# EAGLE design miniTelemetry (EAGLE 5.11)
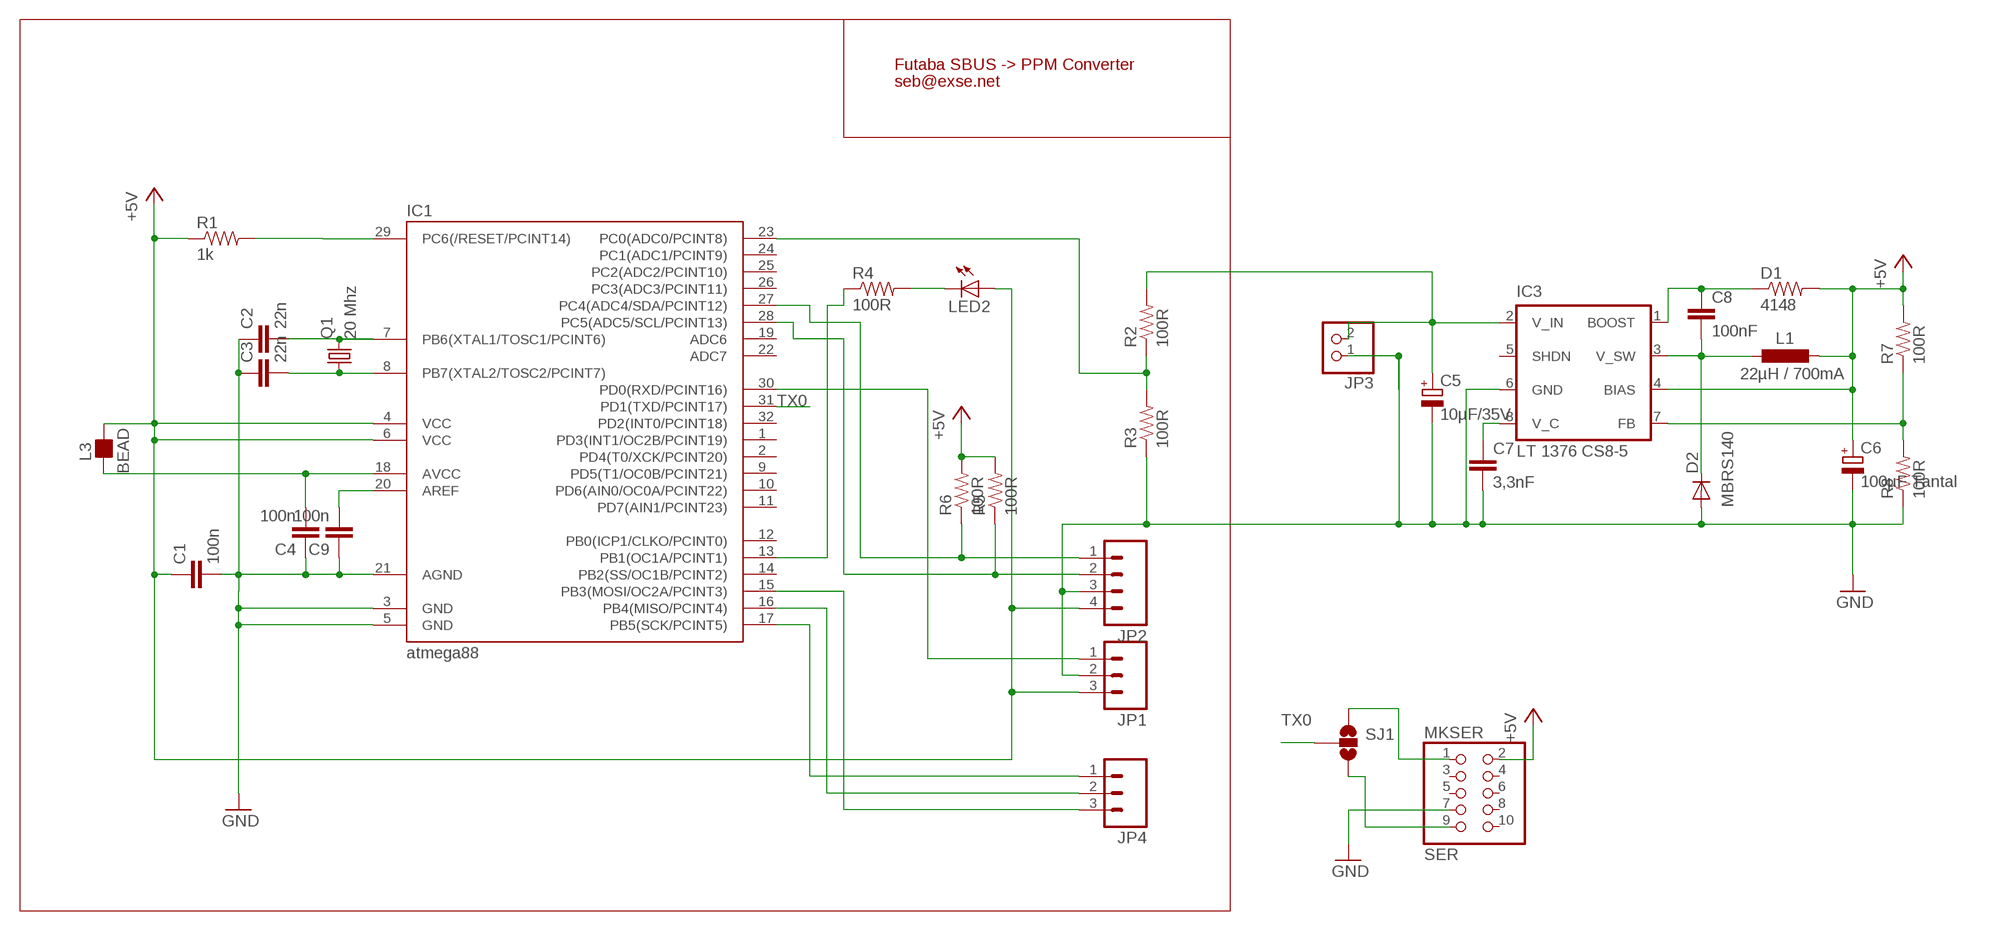
[diagram p0: schematic, sheet 1]

## Parts
C1  100n  CAP0805  [0805]
C2  22n  CAP0805  [0805]
C3  22n  CAP0805  [0805]
C4  100n  CAP0805  [0805]
C5  10µF/35V  CPOL-EUSMCD  [SMC_D]
C6  100µF Tantal  CPOL-EUSMCD  [SMC_D]
C7  3,3nF  CAP0805  [0805]
C8  100nF  CAP0805  [0805]
C9  100n  CAP0805  [0805]
D1  4148  RESISTOR1206  [1206]
D2  MBRS140  DIODE-SMB  [SMB]
IC1  atmega88  MEGA48/88/168-AU  [TQFP32-08]
IC3  LT 1376 CS8-5  LT1376  [SO-08]
JP1  M031X03_NO_SILK  [1X03_NO_SILK]
JP2  M041X04_NO_SILK  [1X04_NO_SILK]
JP3  PINHD-1X02_2.54-90°  [1X02/90]
JP4  M031X03_NO_SILK  [1X03_NO_SILK]
L1  22µH / 700mA  PIS2408  [PIS2408]
L3  BEAD  FB_0805  [L0805]
LED2  LEDCHIPLED_0805  [CHIPLED_0805]
MKSER  SER  PINHD-2X5/90  [2X05/90]
Q1  20 Mhz  CRYSTAL5X3  [CRYSTAL-SMD-5X3]
R1  1k  RESISTOR  [0805]
R2  100R  RESISTOR  [0805]
R3  100R  RESISTOR  [0805]
R4  100R  RESISTOR  [0805]
R5  100R  RESISTOR  [0805]
R6  100R  RESISTOR  [0805]
R7  100R  RESISTOR  [0805]
R8  100R  RESISTOR  [0805]
SJ1  SOLDERJUMPER_2WAYS  [SJ_3]

## Nets
+5V: C1.1 C6.+ D1.2 IC1.4(VCC) IC1.6(VCC) IC3.4(BIAS) JP1.3 JP2.4 L1.P$2 L3.2 LED2.A MKSER.2 R1.1 R5.2 R6.2 R7.2
GND: C1.2 C2.1 C3.1 C4.1 C5.- C6.- C7.2 C9.1 D2.A IC1.3(GND) IC1.5(GND) IC1.21(AGND) IC3.6(GND) JP1.2 JP2.3 JP3.1 MKSER.7 R3.1 R8.1
N$1: IC1.17(PB5(SCK/PCINT5)) JP4.1
N$2: IC1.28(PC5(ADC5/SCL/PCINT13)) JP2.2 R5.1
N$3: IC1.27(PC4(ADC4/SDA/PCINT12)) JP2.1 R6.1
N$4: IC1.23(PC0(ADC0/PCINT8)) R2.1 R3.2
N$5: MKSER.9 SJ1.3
N$6: MKSER.1 SJ1.1
N$7: IC1.16(PB4(MISO/PCINT4)) JP4.2
N$8: IC1.29(PC6(/RESET/PCINT14)) R1.2
N$9: C3.2 IC1.8(PB7(XTAL2/TOSC2/PCINT7)) Q1.1
N$10: C2.2 IC1.7(PB6(XTAL1/TOSC1/PCINT6)) Q1.3
N$11: IC1.15(PB3(MOSI/OC2A/PCINT3)) JP4.3
N$12: IC3.7(FB) R7.1 R8.2
N$13: C4.2 IC1.18(AVCC) L3.1
N$14: LED2.C R4.2
N$15: IC1.13(PB1(OC1A/PCINT1)) R4.1
N$16: C9.2 IC1.20(AREF)
N$41: C5.+ IC3.2(V_IN) JP3.2 R2.2
N$56: C7.1 IC3.8(V_C)
N$57: C8.2 D2.C IC3.3(V_SW) L1.P$1
N$58: C8.1 D1.1 IC3.1(BOOST)
RX0: IC1.30(PD0(RXD/PCINT16)) JP1.1
TX0: IC1.31(PD1(TXD/PCINT17)) SJ1.2
Unconnected: IC1.1(PD3(INT1/OC2B/PCINT19)) IC1.2(PD4(T0/XCK/PCINT20)) IC1.9(PD5(T1/OC0B/PCINT21)) IC1.10(PD6(AIN0/OC0A/PCINT22)) IC1.11(PD7(AIN1/PCINT23)) IC1.12(PB0(ICP1/CLKO/PCINT0)) IC1.14(PB2(SS/OC1B/PCINT2)) IC1.19(ADC6) IC1.22(ADC7) IC1.24(PC1(ADC1/PCINT9)) IC1.25(PC2(ADC2/PCINT10)) IC1.26(PC3(ADC3/PCINT11)) IC1.32(PD2(INT0/PCINT18)) IC3.5(SHDN) MKSER.3 MKSER.4 MKSER.5 MKSER.6 MKSER.8 MKSER.10

## Notes on the sheet
- Futaba SBUS -> PPM Converter
- seb@exse.net

## Library data of the parts
C1-C4 C7-C9 = SparkFun:CAP: Capacitor Standard 0603 ceramic capacitor, and 0.1" leaded capacitor.
C5 C6 = resistor:CPOL-EU: POLARIZED CAPACITOR, European symbol
D1 R1-R8 = SparkFun:RESISTOR: Resistor Basic schematic elements and footprints for 0603, 1206, and PTH 1/10th watt (small) resistors.
D2 = diode:DIODE-: DIODE
IC1 = avr-4:MEGA48/88/168
IC3 = v-reg:LT1376
JP1 JP4 = SparkFun:M03: Header 3 Standard 3-pin 0.1" header. Use with straight break away headers (SKU : PRT-00116), right angle break away headers (PRT-00553), swiss pins (PRT-00743), machine pins (PRT-00117), and female headers (PRT-00115). Molex polarized connector foot print use with SKU : PRT-08232 with associated crimp pins and housings.
JP2 = SparkFun:M04: Header 4 Standard 4-pin 0.1" header. Use with straight break away headers (SKU : PRT-00116), right angle break away headers (PRT-00553), swiss pins (PRT-00743), machine pins (PRT-00117), and female headers (PRT-00115). Molex polarized connector foot print use with SKU : PRT-08231 with associated crimp pins and housings.
JP3 = pinhead-2:PINHD-1X02: PIN HEADER
L1 = seb:PIS2408
L3 = rc-master-smd:FB_: FERRITE BEAD
LED2 = led:LED: LED OSRAM: - CHIPLED LG R971, LG N971, LY N971, LG Q971, LY Q971, LO R971, LY R971 LH N974, LH R974 LS Q976, LO Q976, LY Q976 LO Q996 - Hyper CHIPLED LW Q18S LB Q993, LB Q99A, LB R99A - SideLED LS A670, LO A670, LY A670, LG A670, LP A670 LB A673, LV A673, LT A673, LW A673 LH A674 LY A675 LS A676, LA A676, LO A676, LY A676, LW A676 LS A679, LY A679, LG A679 - Hyper Micro SIDELED® LS Y876, LA Y876, LO Y876, LY Y876 LT Y87S - SmartLED LW L88C, LW L88S LB L89C, LB L89S, LG L890 LS L89K, LO L89K, LY L89K LS L896, LA L896, LO L896, LY L896 - TOPLED LS T670, LO T670, LY T670, LG T670, LP T670 LSG T670, LSP T670, LSY T670, LOP T670, LYG T670 LG T671, LOG T671, LSG T671 LB T673, LV T673, LT T673, LW T673 LH T674 LS T676, LA T676, LO T676, LY T676, LB T676, LH T676, LSB T676, LW T676 LB T67C, LV T67C, LT T67C, LS T67K, LO T67K, LY T67K, LW E67C LS E67B, LA E67B, LO E67B, LY E67B, LB E67C, LV E67C, LT E67C LW T67C LS T679, LY T679, LG T679 LS T770, LO T770, LY T770, LG T770, LP T770 LB T773, LV T773, LT T773, LW T773 LH T774 LS E675, LA E675, LY E675, LS T675 LS T776, LA T776, LO T776, LY T776, LB T776 LHGB T686 LT T68C, LB T68C - Hyper Mini TOPLED® LB M676 - Mini TOPLED Santana® LG M470 LS M47K, LO M47K, LY M47K Source: http://www.osram.convergy.de LUXEON: - LUMILED® LXK2-PW12-R00, LXK2-PW12-S00, LXK2-PW14-U00, LXK2-PW14-V00 LXK2-PM12-R00, LXK2-PM12-S00, LXK2-PM14-U00 LXK2-PE12-Q00, LXK2-PE12-R00, LXK2-PE12-S00, LXK2-PE14-T00, LXK2-PE14-U00 LXK2-PB12-K00, LXK2-PB12-L00, LXK2-PB12-M00, LXK2-PB14-N00, LXK2-PB14-P00, LXK2-PB14-Q00 LXK2-PR12-L00, LXK2-PR12-M00, LXK2-PR14-Q00, LXK2-PR14-R00 LXK2-PD12-Q00, LXK2-PD12-R00, LXK2-PD12-S00 LXK2-PH12-R00, LXK2-PH12-S00 LXK2-PL12-P00, LXK2-PL12-Q00, LXK2-PL12-R00 Source: www.luxeon.com KINGBRIGHT: KA-3528ASYC Source: www.kingbright.com
MKSER = pinhead:PINHD-2X5: PIN HEADER
Q1 = SparkFun:CRYSTAL: Crystals Various standard crystals. Proven footprints. Spark Fun Electronics SKU : COM-00534
SJ1 = SparkFun:SOLDERJUMPER_2WAY: Solder Jumper 2 way solder jumper

## Board
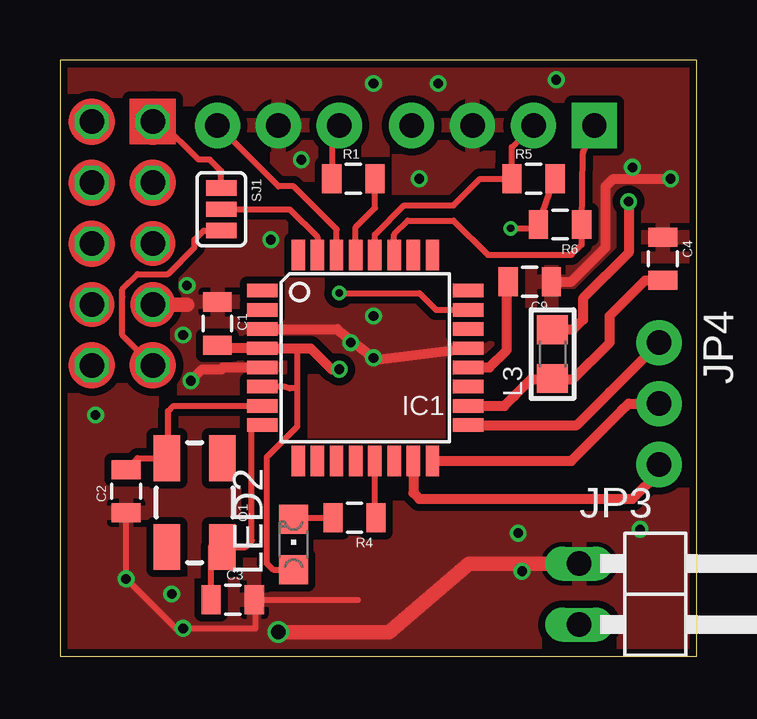
[diagram p1: board, top side]
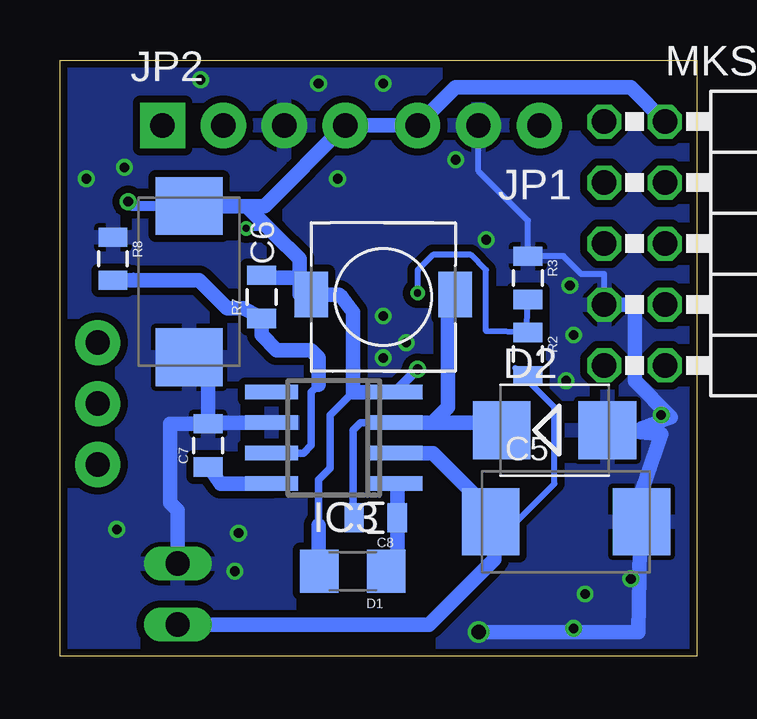
[diagram p2: board, bottom side, seen from below]

Size 26.56 x 24.85 mm. Coordinates in mm from the lower left corner, seen from the top.
Outline: 0,0 26.56,0 26.56,24.85 0,24.85 0,0
Copper layers (1*16): Top 0.035mm / dielectric 1.5mm / Bottom 0.035mm
Design rules "PCB-POOL Standard *": minimum track width 0.15mm, minimum drill 0.3mm, track to track 0.15mm, track to pad 0.15mm, pad to pad 0.15mm, via to via 0.15mm, smd to smd 0.15mm, copper to edge 0.3mm, drill to drill 0.2mm, minimum pad ring 0.2mm, minimum via ring 0.15mm, stop-mask expansion 0.075mm, vias tented up to drill 100mil, thermal gap 0.2mm

### Footprints (pad centres in the part's own frame; a part is rotated, then mirrored left to right if it is on the bottom)
0805 = smd 0.8 x 1.2: 1 -0.9,0; 2 0.9,0
SMC_D = smd 2.4 x 2.8: + -3.15,0; - 3.15,0
1206 = smd 1.6 x 1.8: 1 -1.4,0; 2 1.4,0
SMB = smd 2.4 x 2.4: A 2.2,0; C -2.2,0
TQFP32-08 = smd 1.27 x 0.559: 1 -4.293,2.8; 2 -4.293,2; 3 -4.293,1.2; 4 -4.293,0.4; 5 -4.293,-0.4; 6 -4.293,-1.2; 7 -4.293,-2; 8 -4.293,-2.8; 17 4.293,-2.8; 18 4.293,-2; 19 4.293,-1.2; 20 4.293,-0.4; 21 4.293,0.4; 22 4.293,1.2; 23 4.293,2; 24 4.293,2.8 | smd 0.559 x 1.27: 9 -2.8,-4.293; 10 -2,-4.293; 11 -1.2,-4.293; 12 -0.4,-4.293; 13 0.4,-4.293; 14 1.2,-4.293; 15 2,-4.293; 16 2.8,-4.293; 25 2.8,4.293; 26 2,4.293; 27 1.2,4.293; 28 0.4,4.293; 29 -0.4,4.293; 30 -1.2,4.293; 31 -2,4.293; 32 -2.8,4.293
SO-08 = smd 0.6 x 2.2: 1 -1.905,-2.6; 2 -0.635,-2.6; 3 0.635,-2.6; 4 1.905,-2.6; 5 1.905,2.6; 6 0.635,2.6; 7 -0.635,2.6; 8 -1.905,2.6
1X03_NO_SILK = drill 1.016 pad 1.88 round: 1 0,0; 2 2.54,0; 3 5.08,0
1X04_NO_SILK = drill 1.016 pad 1.88 square: 1 0,0 | drill 1.016 pad 1.88 round: 2 2.54,0; 3 5.08,0; 4 7.62,0
1X02/90 = drill 1.016 long: 1 -2.54,-3.81; 2 0,-3.81
PIS2408 = smd 1.4 x 1.9: P$1 -3,-0.1; P$2 3,-0.1
L0805 = smd 1.2 x 1.3: 1 -1.016,0; 2 1.016,0
CHIPLED_0805 = smd 1.2 x 1.2: A 0,-1.05; C 0,1.05
2X05/90 = drill 1.016 octagon: 1 -5.08,-6.35; 2 -5.08,-3.81; 3 -2.54,-6.35; 4 -2.54,-3.81; 5 0,-6.35; 6 0,-3.81; 7 2.54,-6.35; 8 2.54,-3.81; 9 5.08,-6.35; 10 5.08,-3.81
CRYSTAL-SMD-5X3 = smd 1.9 x 1.1: 1 -1.85,-1.15; 2 1.85,-1.15; 3 1.85,1.15; 4 -1.85,1.15
SJ_3 = smd 0.635 x 1.27: 1 -0.889,0; 2 0,0; 3 0.889,0

### Placement (x,y rotation side)
C1  6.57,13.87 90 top
C2  2.76,6.88 90 top
C3  7.2,2.36 180 top
C4  25.14,16.57 270 top
C5  5.45,5.61 0 bottom
C6  21.17,15.61 270 bottom
C7  20.38,8.79 90 bottom
C8  13.39,5.77 180 bottom
C9  19.58,15.61 180 top
D1  14.34,3.55 180 bottom
D2  5.93,9.42 0 bottom
IC1  12.73,12.44 0 top
IC3  15.14,9.11 90 bottom
JP1  6.57,22.12 180 bottom
JP2  22.28,22.12 0 bottom
JP3  25.46,1.33 270 top
JP4  24.98,13.07 270 top
L1  13.07,14.98 180 bottom
L3  20.54,12.6 90 top
LED2  9.74,4.66 0 top
MKSER  -2.48,17.2 270 bottom
Q1  5.61,6.41 90 top
R1  12.24,19.9 0 top
R2  7.04,12.6 270 bottom
R3  7.04,15.77 270 bottom
R4  12.28,5.77 180 top
R5  19.74,19.9 0 top
R6  20.85,18 180 top
R7  18.15,14.98 90 bottom
R8  24.35,16.57 270 bottom
SJ1  6.72,18.63 270 top

### Tracks (layer width: path | path; a pad name or v marks a point on that pad's centre or on a via)
+5V  (via drill 0.3, 0.4)
  Top 0.254: LED2.A 8.89,3.61 8.63,3.87 8.63,8.31 9.9,9.58 9.9,11.17 | 9.9,11.17 9.58,11.17 9.35,11.24 IC1.6 | IC1.4 9.34,12.84 9.58,12.76 9.9,12.92 9.9,11.17 | R5.2 20.59,19.85 R6.2 19.95,17.84 v18.79,17.84 | R1.1 11.34,21.81 JP1.3
  Top 0.406: v23.71,18.95 23.71,16.82 21.81,14.92 21.81,14.03 21.39,13.61 L3.2 | C1.1 6.69,12.84 IC1.4 10.45,12.84 11.33,11.96 v11.65,11.96
  Bottom 0.254: v18.79,17.84 17.84,17.84 17.6,17.6
  Bottom 0.305: 14.34,11.01 15.3,10.06 15.3,7.84 15.77,7.36 15.77,5.3
  Bottom 0.406: v23.71,18.95 23.53,18.76 C6.+ | IC3.4 12.54,11.07 v11.65,11.96
  Bottom 0.61: D1.2 15.77,3.68 15.77,5.3 15.77,5.45 | IC3.4 14.34,11.01 14.34,14.34 14.82,14.98 14.92,15.08 L1.P$2 16.57,15.1 16.57,15.77 | 16.57,15.77 16.57,16.57 17.6,17.6 18.76,18.76 | 18.76,18.76 C6.+ | JP2.4 18.02,18.76 18.76,18.76 | JP2.4 | JP2.4 JP1.3 10.06,23.71 2.76,23.71 MKSER.2 | R7.2 18.37,15.77 16.57,15.77
GND  (via drill 0.4, 0.6)
  Top 0.254: 12.42,2.36 C3.1 8.15,2.41 8.15,1.17 4.82,1.17 v2.76,3.23 | v2.76,3.23 C2.1 v2.76,3.23
  Top 0.406: C9.1 21.33,15.61 22.76,17.04 22.76,19.58 23.08,19.9 v25.46,19.9 | IC1.21 13.15,12.36 v13.07,12.44 11.56,13.64 IC1.3 | IC1.5 6.8,12.04 6.72,11.96 5.93,11.96 v5.45,11.49
  Top 0.61: MKSER.7 5.3,14.66 | MKSER.7 | v9.11,1.01 13.71,1.01 17.04,3.87 JP3.1
  Bottom 0.254: 2.3,9.5 D2.A 3.42,9.74 3.41,9.74 | 2.36,5.69 2.36,5.67 C5.- 2.3,3.68 v2.76,3.23 | JP1.2 9.11,20.22 7.04,18.15 R3.1 5.56,16.67 4.82,15.93 3.87,15.93 MKSER.7
  Bottom 0.61: 2.28,5.77 2.36,5.69 2.44,1.01 7.68,1.01 v9.11,1.01 | 3.41,9.74 3.07,9.4 1.49,9.26 2.3,6.91 C5.- | 2.3,9.5 1.09,9.97 2.6,11.49 2.6,14.66 MKSER.7 | IC3.6 20.38,9.74 C7.2 | C6.- 20.38,12.46 C7.2 | C7.2 21.96,9.69 21.96,6.41 21.65,6.09 JP3.1
  other vias: 15.77,23.87 1.49,10.06 4.66,2.6 19.27,3.55 20.69,24.03 13.07,23.87 5.3,15.46 12.12,13.07 13.07,14.19 8.79,17.36 23.87,20.38 14.98,19.9 10.06,20.69 24.19,5.3 5.14,1.17 19.11,5.14 5.14,13.39
  pour Top (isolate 0.305): 0.06,24.82 26.57,24.82 26.57,-0.26 0.06,-0.26
  pour Bottom (isolate 0.305): 0.06,24.82 26.57,24.82 26.57,-0.26 0.06,-0.26
N$1
  Top 0.406: IC1.17 21.55,9.64 22.92,11.01 JP4.1 | JP4.1
N$2
  Top 0.254: IC1.28 13.13,17.58 14.34,18.79 16.41,18.79 17.52,19.9 R5.1 18.84,21.22 JP2.2
N$3
  Top 0.254: IC1.27 13.93,17.58 14.5,18.15 16.41,18.15 17.84,16.73 21.01,16.73 21.33,16.73 21.75,17.15 R6.1 21.81,20.96 JP2.1
N$4  (via drill 0.3)
  Top 0.254: IC1.23 15.68,14.44 14.98,15.14 v11.65,15.14 | v11.65,15.14
  Bottom 0.254: v11.65,15.14 11.65,16.09 11.01,16.73 9.42,16.73 8.79,16.09 8.79,13.55 R2.1 7.1,13.82 R3.2
N$5
  Top 0.254: MKSER.9 2.6,13.39 2.6,14.98 2.6,15.3 3.23,15.93 4.5,15.93 5.61,17.04 5.61,17.36 5.99,17.74 SJ1.3
N$6
  Top 0.254: SJ1.1 | SJ1.1 6.72,20.22 6.25,20.69 5.77,20.69 4.18,22.28 MKSER.1
N$7
  Top 0.406: IC1.16 21.32,8.15 23.39,10.22 23.71,10.53 JP4.2
N$8
  Top 0.254: IC1.29 12.33,17.89 12.92,18.47 13.14,18.69 R1.2
N$9
  Top 0.254: IC1.8 7.99,9.51 7.99,4.82 7.73,4.56 Q1.1 6.3,4.57 C3.2
N$10
  Top 0.254: 6.09,10.44 4.72,10.44 4.5,10.22 4.5,9.09 Q1.3 3.23,8.26 C2.2 | 6.09,10.44 IC1.7 | 6.09,10.44
N$11
  Top 0.406: IC1.15 14.73,6.81 14.98,6.57 23.87,6.57 24.98,7.68 24.98,7.84 JP4.3
N$12
  Bottom 0.254: R8.2 23.5,15.88
  Bottom 0.305: IC3.7 16.41,8.47 16.09,8.79 16.09,11.01 15.77,11.33
  Bottom 0.61: R7.1 18.9,14.5 19.58,14.5 20.75,15.67 R8.2 | R7.1 | R7.1 18.15,13.39 17.52,12.76 16.09,12.76 15.77,12.44 15.77,11.33
N$13
  Top 0.406: IC1.18 18.54,10.44 18.95,10.85 19.65,11.55 20.54,11.55 | C4.2 24.4,15.67 22.92,14.19 22.92,13.07 21.39,11.55 20.54,11.55 | 20.54,11.55 L3.1
N$14
  Top 0.254: LED2.C 9.8,5.77 R4.2
N$15
  Top 0.254: R4.1 13.13,6.04 IC1.13
N$16
  Top 0.406: C9.2 18.63,14.77 18.63,12.76 17.91,12.04 IC1.20
N$41
  Bottom 0.254: C5.+ 7.52,5.61 5.93,7.2 5.93,10.38 7.57,12.02 R2.2
  Bottom 0.61: IC3.2 | IC3.2 11.01,8.47 10.69,8.15 8.6,6.06 C5.+ 8.45,4.16 8.45,4.05 11.17,1.33 18.63,1.33 JP3.2
N$56
  Bottom 0.61: IC3.8 19.85,7.2 20.32,7.84 C7.1
N$57
  Bottom 0.305: 14.34,5.98 14.34,7.99 14.34,9.42 14.03,9.74 IC3.3
  Bottom 0.61: L1.P$1 10.38,14.9 10.38,10.38 10.85,9.9 11.01,9.74 | 14.34,5.98 C8.2 | 11.01,9.74 IC3.3 | D2.C 8.45,9.74 11.01,9.74
N$58
  Bottom 0.61: IC3.1 12.49,7.15 C8.1 12.49,4 D1.1
RX0
  Top 0.254: JP1.1 9.11,19.58 9.74,19.58 11.53,17.79 IC1.30
TX0
  Top 0.254: IC1.31 10.73,17.48 9.58,18.63 8.63,18.63 SJ1.2
(copper drawn outside any net)
  shapes: Top area x1, Top circle x10

### Text on the board
tStop: seb@exse.net